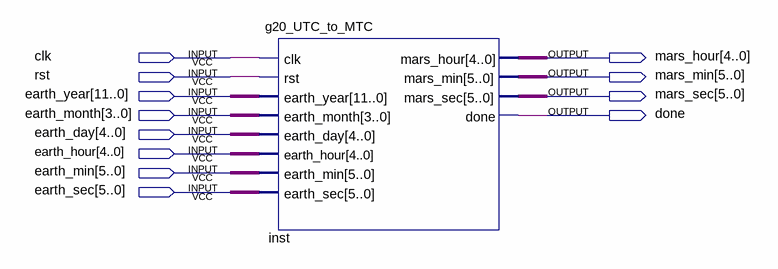
[diagram p0: schematic sheet]
// Quartus schematic g20_UTC_to_MTC.bdf as structural Verilog: 1 symbols, 12 pins
module g20_UTC_to_MTC (
  input  clk,
  input  rst,
  input  [11:0] earth_year,
  input  [3:0] earth_month,
  input  [4:0] earth_day,
  input  [4:0] earth_hour,
  input  [5:0] earth_min,
  input  [5:0] earth_sec,
  output [4:0] mars_hour,
  output [5:0] mars_min,
  output [5:0] mars_sec,
  output done
);

  g20_UTC_to_MTC inst (
    .clk(clk), .rst(rst), .earth_year(earth_year), .earth_month(earth_month), .earth_day(earth_day),
    .earth_hour(earth_hour), .earth_min(earth_min), .earth_sec(earth_sec), .mars_hour(mars_hour),
    .mars_min(mars_min), .mars_sec(mars_sec), .done(done));
endmodule
